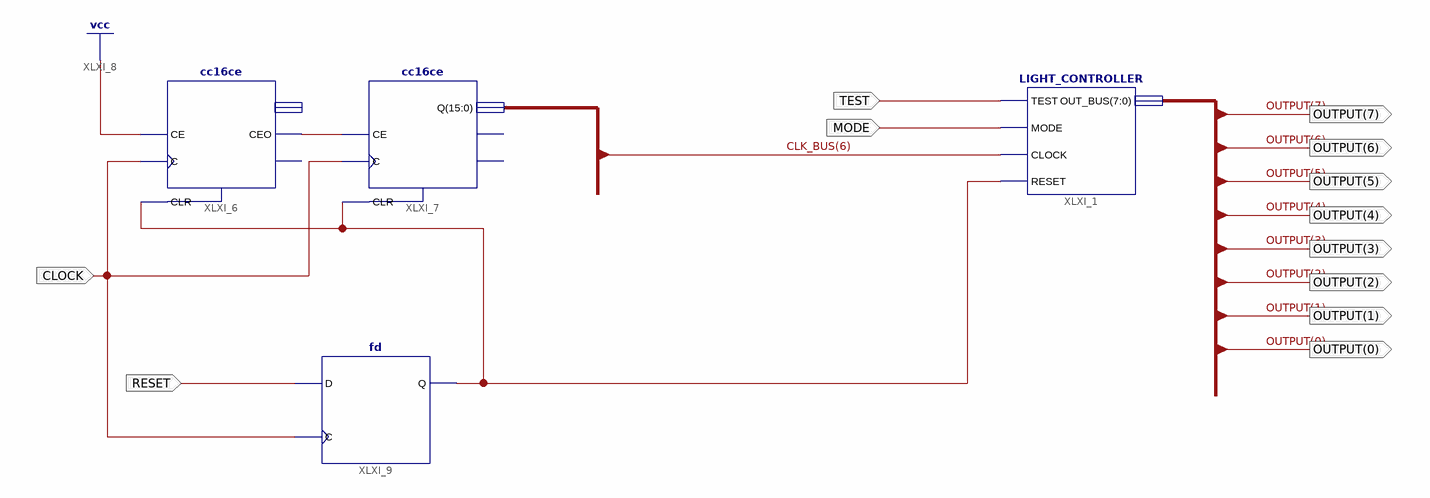
[diagram p0: schematic sheet 1]
// Xilinx ISE schematic TOP_SCHEME.sch (spartan3a) as structural Verilog: 4 symbols, 12 ports
module TOP_SCHEME (
  input  TEST,
  input  MODE,
  input  CLOCK,
  input  RESET,
  output [7:0] OUTPUT
);

  wire XLXN_32, XLXN_41;
  wire [15:0] CLK_BUS;

  LIGHT_CONTROLLER XLXI_1 (.TEST(TEST), .MODE(MODE), .CLOCK(CLK_BUS[6]), .RESET(XLXN_41), .OUT_BUS(OUTPUT));
  cc16ce XLXI_6 (.C(CLOCK), .CE(1'b1), .CLR(XLXN_41), .CEO(XLXN_32));  // open: Q, TC
  cc16ce XLXI_7 (.C(CLOCK), .CE(XLXN_32), .CLR(XLXN_41), .Q(CLK_BUS));  // open: CEO, TC
  fd XLXI_9 (.C(CLOCK), .D(RESET), .Q(XLXN_41));
endmodule
